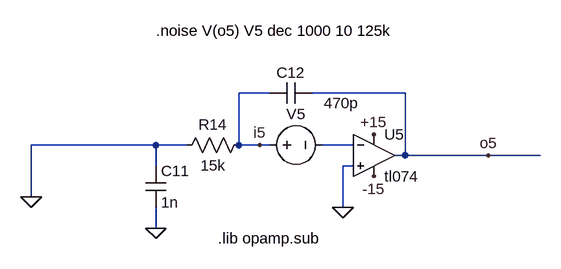
[diagram p0: schematic filtro ruido o5.asc]
filtro ruido o5.asc, the LTspice schematic file:
Version 4
SHEET 1 1900 680
WIRE -928 -496 -976 -496
WIRE -720 -496 -864 -496
WIRE -1104 -416 -1296 -416
WIRE -1056 -416 -1104 -416
WIRE -976 -416 -976 -496
WIRE -944 -416 -976 -416
WIRE -928 -416 -944 -416
WIRE -800 -416 -848 -416
WIRE -720 -400 -720 -496
WIRE -720 -400 -736 -400
WIRE -592 -400 -720 -400
WIRE -512 -400 -592 -400
WIRE -1104 -384 -1104 -416
WIRE -800 -384 -816 -384
WIRE -1296 -336 -1296 -416
WIRE -816 -320 -816 -384
WIRE -1104 -288 -1104 -320
FLAG -816 -320 0
FLAG -1104 -288 0
FLAG -768 -432 +15
FLAG -768 -368 -15
FLAG -1296 -336 0
FLAG -944 -416 i5
FLAG -592 -400 o5
SYMBOL cap -1120 -384 R0
SYMATTR InstName C11
SYMATTR Value 1n
SYMBOL res -1072 -400 R270
WINDOW 0 32 56 VTop 2
WINDOW 3 0 56 VBottom 2
SYMATTR InstName R14
SYMATTR Value 15k
SYMBOL cap -928 -480 R270
WINDOW 0 32 32 VTop 2
WINDOW 3 16 110 VBottom 2
SYMATTR InstName C12
SYMATTR Value 470p
SYMBOL tl074\\tl074 -768 -464 R0
SYMATTR InstName U5
SYMBOL voltage -944 -416 R270
WINDOW 0 32 56 VTop 2
WINDOW 3 -32 56 VBottom 2
SYMATTR InstName V5
SYMATTR Value ""
TEXT -1008 -272 Left 2 !.lib opamp.sub
TEXT -1104 -592 Left 2 !.noise V(o5) V5 dec 1000 10 125k

The netlist it stands for:
* filtro ruido o5.asc
C11 0 0 1n
R14 0 i5 15k
C12 i5 o5 470p
* U5: tl074 (symbol tl074\tl074 not available, pins judged from their places): In+=0 In-=N001 V+=+15 V-=-15 OUT=o5
V5 i5 N001
.lib opamp.sub
.noise V(o5) V5 dec 1000 10 125k
.backanno
.end